# Altium schematic sheet Controller.SchDoc
size A3; SheetNumber: 1; SheetTotal: 1
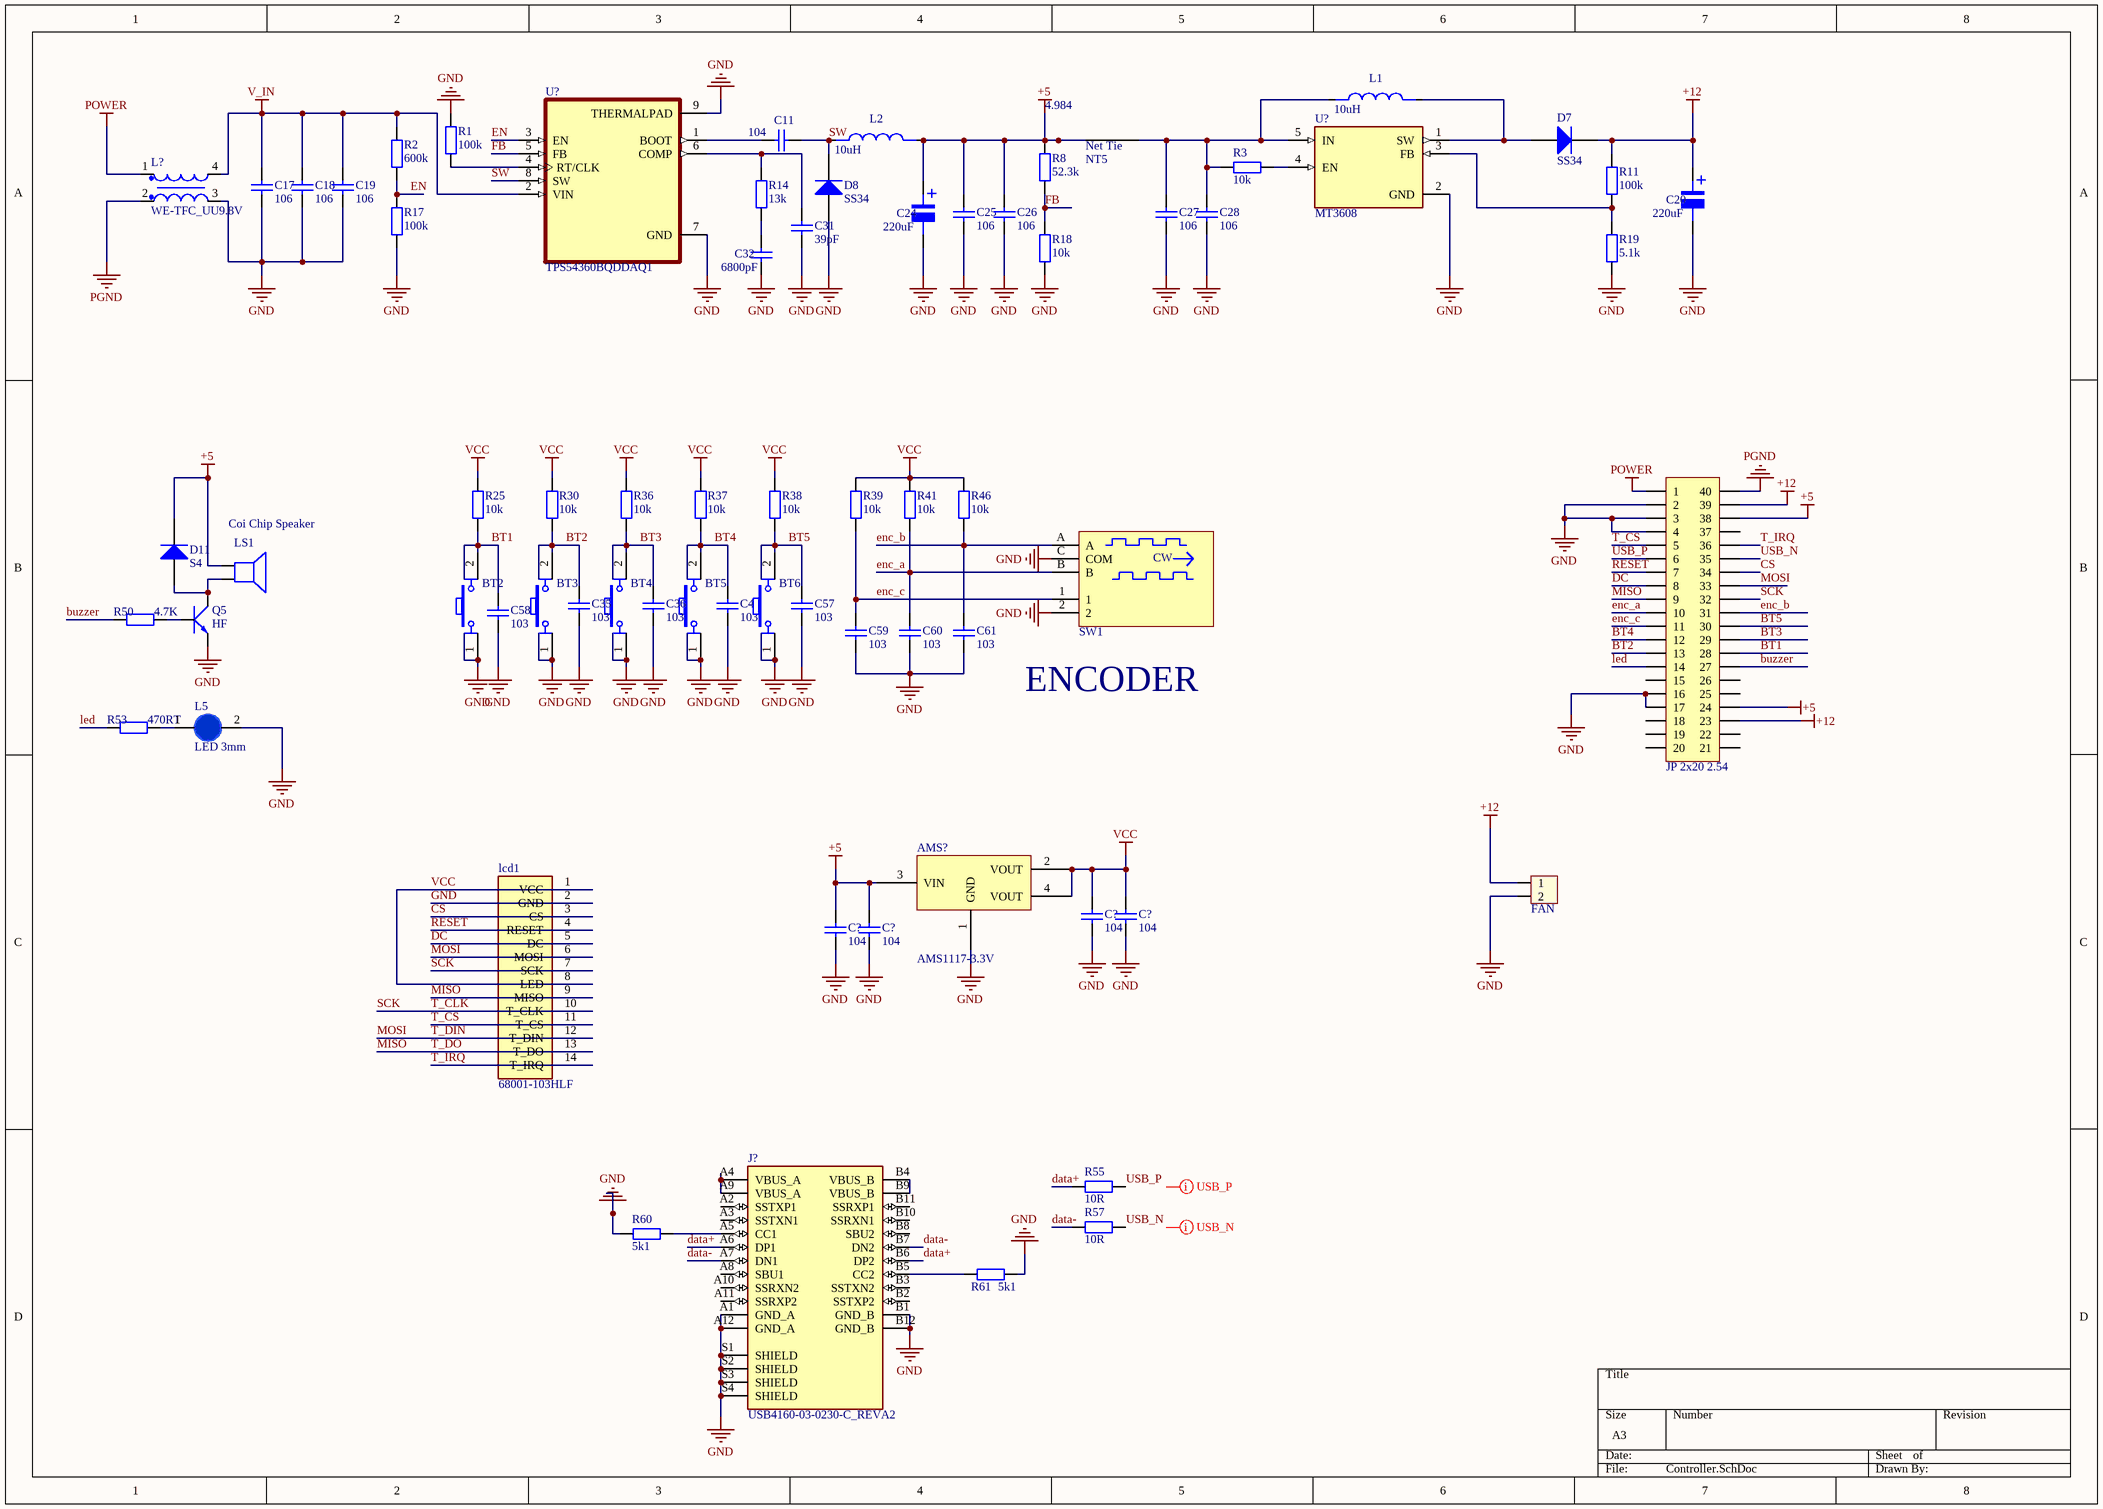
[diagram p0: Controller.SchDoc]

## Parts
(Parts that share a designator on the sheet are numbered #1, #2 ... from top to bottom, then left to right.)
AMS?  AMS1117-3.3V  [SOT223]
BT2  Nut Nhan 4 Chan Cam 6x6  [Nut Nhan 4 Chan Cam 6x6]  (value not drawn)
BT3  Nut Nhan 4 Chan Cam 6x6  [Nut Nhan 4 Chan Cam 6x6]  (value not drawn)
BT4  Nut Nhan 4 Chan Cam 6x6  [Nut Nhan 4 Chan Cam 6x6]  (value not drawn)
BT5  Nut Nhan 4 Chan Cam 6x6  [Nut Nhan 4 Chan Cam 6x6]  (value not drawn)
BT6  Nut Nhan 4 Chan Cam 6x6  [Nut Nhan 4 Chan Cam 6x6]  (value not drawn)
C11  104  [tu 0603]
C17  106  [tu 0805]
C18  106  [tu 0805]
C19  106  [tu 0805]
C20  220uF  [tu nhom 6.3 (d)]
C24  220uF  [tu nhom 6.3 (d)]
C25  106  [tu 0805]
C26  106  [tu 0805]
C27  106  [tu 0805]
C28  106  [tu 0805]
C31  39pF  [tu 0603]
C32  6800pF  [tu 0603]
C35  103  [tu 0603]
C36  103  [tu 0603]
C42  103  [tu 0603]
C57  103  [tu 0603]
C58  103  [tu 0603]
C59  103  [tu 0603]
C60  103  [tu 0603]
C61  103  [tu 0603]
C?#1  104  [tu 0603]
C?#2  104  [tu 0603]
C?#3  104  [tu 0603]
C?#4  104  [tu 0603]
D7  SS34  [DIODE SMA]
D8  SS34  [DIODE SMA]
D11  S4  [DIODE SOD-123]
H1  FAN  [XH2.54M-2]
J?  USB4160-03-0230-C_REVA2  [GCT_USB4160-03-0230-C_REVA2]
JP?  JP 2x20 2.54  [JP 2x20 DT]
L1  10uH  [CUON CAM SMD 0530]
L2  10uH  [CUON CAM SMD 0530]
L5  LED 3mm  [LED-3MM-BLUE]
L?  WE-TFC_UU9.8V  [WE-TFC_UU9.8V]
lcd1  68001-103HLF  [AMPHENOL_68001-103HLF]
LS1  Coi Chip Speaker  [Coi Chip Speacker]
NT5  NetTie_2mm  [NetTie_2mm]  (value not drawn)  (net tie, no BOM)
Q5  HF  [SOT-23]
R1  100k  [tro smd 0603]
R2  600k  [tro smd 0603]
R3  10k  [tro smd 0603]
R8  52.3k  [tro smd 0603]
R11  100k  [tro smd 0603]
R14  13k  [tro smd 0603]
R17  100k  [tro smd 0603]
R18  10k  [tro smd 0603]
R19  5.1k  [tro smd 0603]
R25  10k  [Tro smd 0603]
R30  10k  [Tro smd 0603]
R36  10k  [Tro smd 0603]
R37  10k  [Tro smd 0603]
R38  10k  [Tro smd 0603]
R39  10k  [Tro smd 0603]
R41  10k  [Tro smd 0603]
R46  10k  [Tro smd 0603]
R50  4.7K  [Tro smd 0603]
R53  470RT  [Tro smd 0603]
R55  10R  [Tro smd 0603]
R57  10R  [Tro smd 0603]
R60  5k1  [tro smd 0603]
R61  5k1  [tro smd 0603]
SW1  482024764004  [482024764004]  (value not drawn)
U?#1  MT3608  [SOT95P280X145-6N]
U?#2  TPS54360BQDDAQ1  [VREG_LM5017MR/NOPB]

## Nets
+5: AMS?.3(VIN) C24.1 C25.1 C26.1 C?#3.1 C?#4.1 D11.2(K) JP?.24 JP?.38 L2.2 LS1.1 NT5.1 R8.2
+12: C20.1 D7.2(K) H1.1 JP?.23 JP?.39 R11.2
GND: AMS?.1(GND) BT2.1 BT3.1 BT4.1 BT5.1 BT6.1 C17.2 C18.2 C19.2 C20.2 C24.2 C25.2 C26.2 C27.2 C28.2 C31.2 C32.2 C35.1 C36.1 C42.1 C57.1 C58.1 C59.1 C60.1 C61.1 C?#1.2 C?#2.2 C?#3.2 C?#4.2 D8.1(A) H1.2 J?.A1(GND_A) J?.A12(GND_A) J?.B1(GND_B) J?.B12(GND_B) J?.S1(SHIELD) J?.S2(SHIELD) J?.S3(SHIELD) J?.S4(SHIELD) JP?.2 JP?.3 JP?.4 JP?.16 JP?.17 L5.2(K) L?.3 lcd1.2(GND) Q5.2(E) R1.1 R17.1 R18.1 R19.1 R60.2 R61.2 SW1.2 SW1.C(COM) U?#1.2(GND) U?#2.7(GND) U?#2.9(THERMALPAD)
PGND: JP?.40 L?.2
POWER: JP?.1 L?.1
V_IN: C17.1 C18.1 C19.1 L?.4 R2.2 U?#2.2(VIN)
VCC: AMS?.2(VOUT) AMS?.4(VOUT) C?#1.1 C?#2.1 lcd1.1(VCC) lcd1.8(LED) R25.2 R30.2 R36.2 R37.2 R38.2 R39.2 R41.2 R46.2
BT1: BT2.2 C58.2 JP?.28 R25.1
BT2: BT3.2 C35.2 JP?.13 R30.1
BT3: BT4.2 C36.2 JP?.29 R36.1
BT4: BT5.2 C42.2 JP?.12 R37.1
BT5: BT6.2 C57.2 JP?.30 R38.1
buzzer: JP?.27 R50.1
CS: JP?.34 lcd1.3(CS)
data+: J?.A6(DP1) J?.B6(DP2) R55.1
data-: J?.A7(DN1) J?.B7(DN2) R57.1
DC: JP?.8 lcd1.5(DC)
EN: R2.1 R17.2 U?#2.3(EN)
enc_a: C60.2 JP?.10 R41.1 SW1.B
enc_b: C61.2 JP?.31 R46.1 SW1.A
enc_c: C59.2 JP?.11 R39.1 SW1.1
FB: R8.1 R18.2 U?#2.5(FB)
led: JP?.14 R53.1
MISO: JP?.9 lcd1.9(MISO) lcd1.13(T_DO)  [also labelled T_DO]
MOSI: JP?.33 lcd1.6(MOSI) lcd1.12(T_DIN)  [also labelled T_DIN]
RESET: JP?.7 lcd1.4(RESET)
SCK: JP?.32 lcd1.7(SCK) lcd1.10(T_CLK)  [also labelled T_CLK]
SW: C11.2 D8.2(K) L2.1 U?#2.8(SW)
T_CS: JP?.5 lcd1.11(T_CS)
T_IRQ: JP?.36 lcd1.14(T_IRQ)
USB_N: JP?.35 R57.2
USB_P: JP?.6 R55.2
NetC11_1: C11.1 U?#2.1(BOOT)
NetC27_1: C27.1 C28.1 L1.1 NT5.2 R3.2 U?#1.5(IN)
NetC31_1: C31.1 R14.1 U?#2.6(COMP)
NetC32_1: C32.1 R14.2
NetD7_1: D7.1(A) L1.2 U?#1.1(SW)
NetD11_1: D11.1(A) LS1.2 Q5.3(C)
NetJ?_A4: J?.A4(VBUS_A) J?.A9(VBUS_A)
NetJ?_A5: J?.A5(CC1) R60.1
NetJ?_B4: J?.B4(VBUS_B) J?.B9(VBUS_B)
NetJ?_B5: J?.B5(CC2) R61.1
NetL5_1: L5.1(A) R53.2
NetQ5_1: Q5.1(B) R50.2
NetR1_2: R1.2 U?#2.4(RT/CLK)
NetR3_1: R3.1 U?#1.4(EN)
NetR11_1: R11.1 R19.2 U?#1.3(FB)

Not connected (* = marked no-connect by the designer): J? A2(SSTXP1) A3(SSTXN1) A8(SBU1) A10(SSRXN2) A11(SSRXP2) B2(SSTXP2) B3(SSTXN2) B8(SBU2) B10(SSRXN1) B11(SSRXP1); JP? 15 18 19 20 21 22 25 26 37

## Layout directives
differential pair: (no net found under the mark)

## Notes on the sheet
- 4.984
- ENCODER
- (in symbol 482024764004) CW
- (in symbol NetTie_2mm) Net Tie
- (in symbol Tu Nhom 220uF 16V) +

## Library data of the parts
AMS? = AMS1117 SMD: Dán; Value: AMS1117-3.3V SOT223; Don_Vi: Con; Ma_Hang: MH000596; Ghi_Chu: *; Kieu_Chan: *; Chung_Loai: Dán
BT2-BT6 = Nut Nhan 4 Chan Cam 6x6: Nut Nhan 4 Chan 6x6mm; Ten: Nút Nhấn 4 Chân 6x6x5MM DIP; Ma_Hang: MH004584
C11 = Tu 0603 104 50V 10%: Dán; Don_Vi: Con; So_Chan: 2; Ten_Linh_Kien: Tụ 0603 104-100nF 10% 50V; Ma_Hang: MH004568; Chung_Loai: Dán; Kieu_Chan: *
C17-C19 C25-C28 = Tu 0805 106 16V 10%: Dán; Ten_Linh_Kien: Tụ 0805 106-10uF 10% 16V; So_Chan: 2; Don_Vi: Con; Ma_Hang: MH004553; Chung_Loai: Dán; Kieu_Chan: *
C20 C24 = Tu Nhom 220uF 16V: Dán; Don_Vi: Con; So_Chan: 2; Ten_Linh_Kien: Tụ Nhôm 220uF 16V 6.3x7.7MM; Ma_Hang: MH002227; Chung_Loai: Dán; Kieu_Chan: *
C31 C32 C35 C36 C42 C57-C61 = Tu 0603 106 16V 20%: Dán; Don_Vi: Con; So_Chan: 2; Ten_Linh_Kien: Tụ 0603-10uF 20% 16V; Ma_Hang: MH004848; Chung_Loai: Dán; Kieu_Chan: *
C?#1-C?#4 = Tu 0603 101 50V 10%: Dán; Don_Vi: Con; So_Chan: 2; Ten_Linh_Kien: Tụ 0603 101-0.1nF 10% 50V; Ma_Hang: MH004565; Chung_Loai: Dán; Kieu_Chan: *
D7 D8 = Diode SS34 ( 1N5822 ): Dán; Don_Vi: Con; Ma_Hang: MH002104; Ten_Linh_Kien: Diode SS34 3A 40V SMA ( 1N5822 SS34A); Kieu_Chan: *; Chung_Loai: Dán
D11 = Diode S4: Dán; Ten_Linh_Kien: Diode S4 SOD123 ( 1N5819 SOD123); Ma_Hang: MH005519; Don_Vi: Con; Ghi_Chu: *; Chung_Loai: Dán; Kieu_Chan: *
H1 = Header 2P 2.54 Duc Thang: Cắm; Ten_Linh_Kien: Header 2P XH2.54-2P Đực Thẳng; Don_Vi: Con; Ma_Hang: MH001283; Chung_Loai: Cắm
JP? = JP 2x20 2.54 Duc Thang: Cắm; Ten_Linh_Kien: Jump Đôi Đực 2.54MM 2x40P Thẳng 11MM; Don_Vi: Con; Ma_Hang: MH002686; Ghi_Chu: *; Kieu_Chan: *; Chung_Loai: Cắm
L1 L2 = Cuon Cam SMD 0530: SMD 0530; MP: FDV0530-H-1R5M=P3; Package: None; Price: None; Value: *; Availability: Unavailable
L5 = LED 3mm Xanh Duong: Cắm; Don_Vi: Con; Ma_Hang: MH009003; Ten_Linh_Kien: LED 3MM Xanh Dương SS (1000c); Ghi_Chu: *; Kieu_Chan: *; Chung_Loai: Cắm
L? = WE-TFC_UU9.8V: Size Typ UU; L = 25 mH; IR = 0.25 A; RDC = 3.6 â„¦; MF: Wurth Electronics; MP: 744862250; SnapEDA_Link: https://www.snapeda.com/parts/744862250/Wurth+Electronics/view-part/?ref=snap; Package: Vertical-4 Wurth Electronics; Value: *; Check_prices: https://www.snapeda.com/parts/744862250/Wurth+Electronics/view-part/?ref=eda
lcd1 = 68001-103HLF: Conn Rect UnshroudedHdr 3Cnts ThruHole BergStik 2.54mmPin-Spng Vert 1-Row | Amphenol FCI (Amphenol CS) 68001-103HLF; SnapEDA_Link: https://www.snapeda.com/parts/68001-103HLF/Amphenol/view-part/?ref=snap; Package: None; Value: *; MF: Amphenol; MP: 68001-103HLF; Check_prices: https://www.snapeda.com/parts/68001-103HLF/Amphenol/view-part/?ref=eda
LS1 = Coi Chip Speaker: Còi chip
Q5 = Trans C1815 HF SMD: SOT-23; Value: C9014
R1-R3 R8 R11 R14 R17-R19 = Tro 0603 1% 0R: Dán; Don_Vi: Con; So_Chan: 2; Ten_Linh_Kien: Trở 0603 1% 0R; Ma_Hang: MH005792; Chung_Loai: Dán; Kieu_Chan: *
R25 R30 R36-R39 R41 R46 R50 R53 R55 R57 = Tro 0603 5% 10R: Dán; So_Chan: 2; Ten_Linh_Kien: Trở 0603 5% 10R; Ma_Hang: MH006317; Don_Vi: Con; Chung_Loai: Dán; Kieu_Chan: *
R60 R61 = Tro 0603 5% 51k: Dán; Don_Vi: Con; So_Chan: 2; Ten_Linh_Kien: Trở 0603 5% 51k; Ma_Hang: MH007666; Chung_Loai: Dán; Kieu_Chan: *
SW1 = 482024764004: WS-ENTV Mechanical Incremental Encoder Switch, Plastic Shaft without bushing, 24Pulse/360°, 24positi; Manufacturer: Wurth Elektronik; Operation Force: 300g; Detent: 24positions; Electrical Life Encoder: 30000Cycles; Electrical Life Switch: 20000Cycles; Insulation Resistance: 100MΩ; Rated Current: 10mA; ComponentLink1Description: Website Link; ComponentLink1URL: https://www.we-online.com/redexpert/article/482024764004?ad; ComponentLink2Description: Datasheet Link; ComponentLink2URL: https://www.we-online.com/redexpert/spec/482024764004?ad; Manufacturer Part Number: 482024764004; Category: Encoder Switches; Match Code: WS-ENTV; Mount: Through Hole; Operating Temperature Max: 85°C; Operating Temperature Min: -40°C; Packaging: Tray; Length: 13.2mm; Width: 12.4mm; Height: 20mm; Resolution: 24Pulse/360°
U?#1 = MT3608: High Efficiency 1.2MHz2A Step Up Converter; MF: Aerosemi Technology Co., Ltd; Price: None; Availability: Not in stock; Package: Package; MP: MT3608; Value: *; SnapEDA_Link: https://www.snapeda.com/parts/MT3608/Aerosemi+Technology+Co.%252C+Ltd/view-part/?ref=snap; Check_prices: https://www.snapeda.com/parts/MT3608/Aerosemi+Technology+Co.%252C+Ltd/view-part/?ref=eda
U?#2 = TPS54360BQDDAQ1: Automotive, 60V Input, 3.5A, Step-Down DC-DC Converter With Eco-mode&trade; 8-SO PowerPAD -40 to 125; MF: Texas Instruments; Purchase-URL: https://pricing.snapeda.com/search/part/TPS54360BQDDAQ1/?ref=eda; Value: *; SnapEDA_Link: https://www.snapeda.com/parts/TPS54360BQDDAQ1/Texas%20Instruments/view-part/1129741/?ref=snap; Package: HSOIC-8 Texas Instruments; MP: TPS54360BQDDAQ1; Check_prices: https://www.snapeda.com/parts/TPS54360BQDDAQ1/Texas%20Instruments/view-part/1129741/?ref=eda; Price: None; Availability: Bad
J? = USB4160-03-0230-C_REVA2: Price: None; Value: *; Package: None; Availability: Unavailable; MP: USB4160-03-0230-C_REVA2